# EAGLE schematic testv3 (EAGLE 6.3)
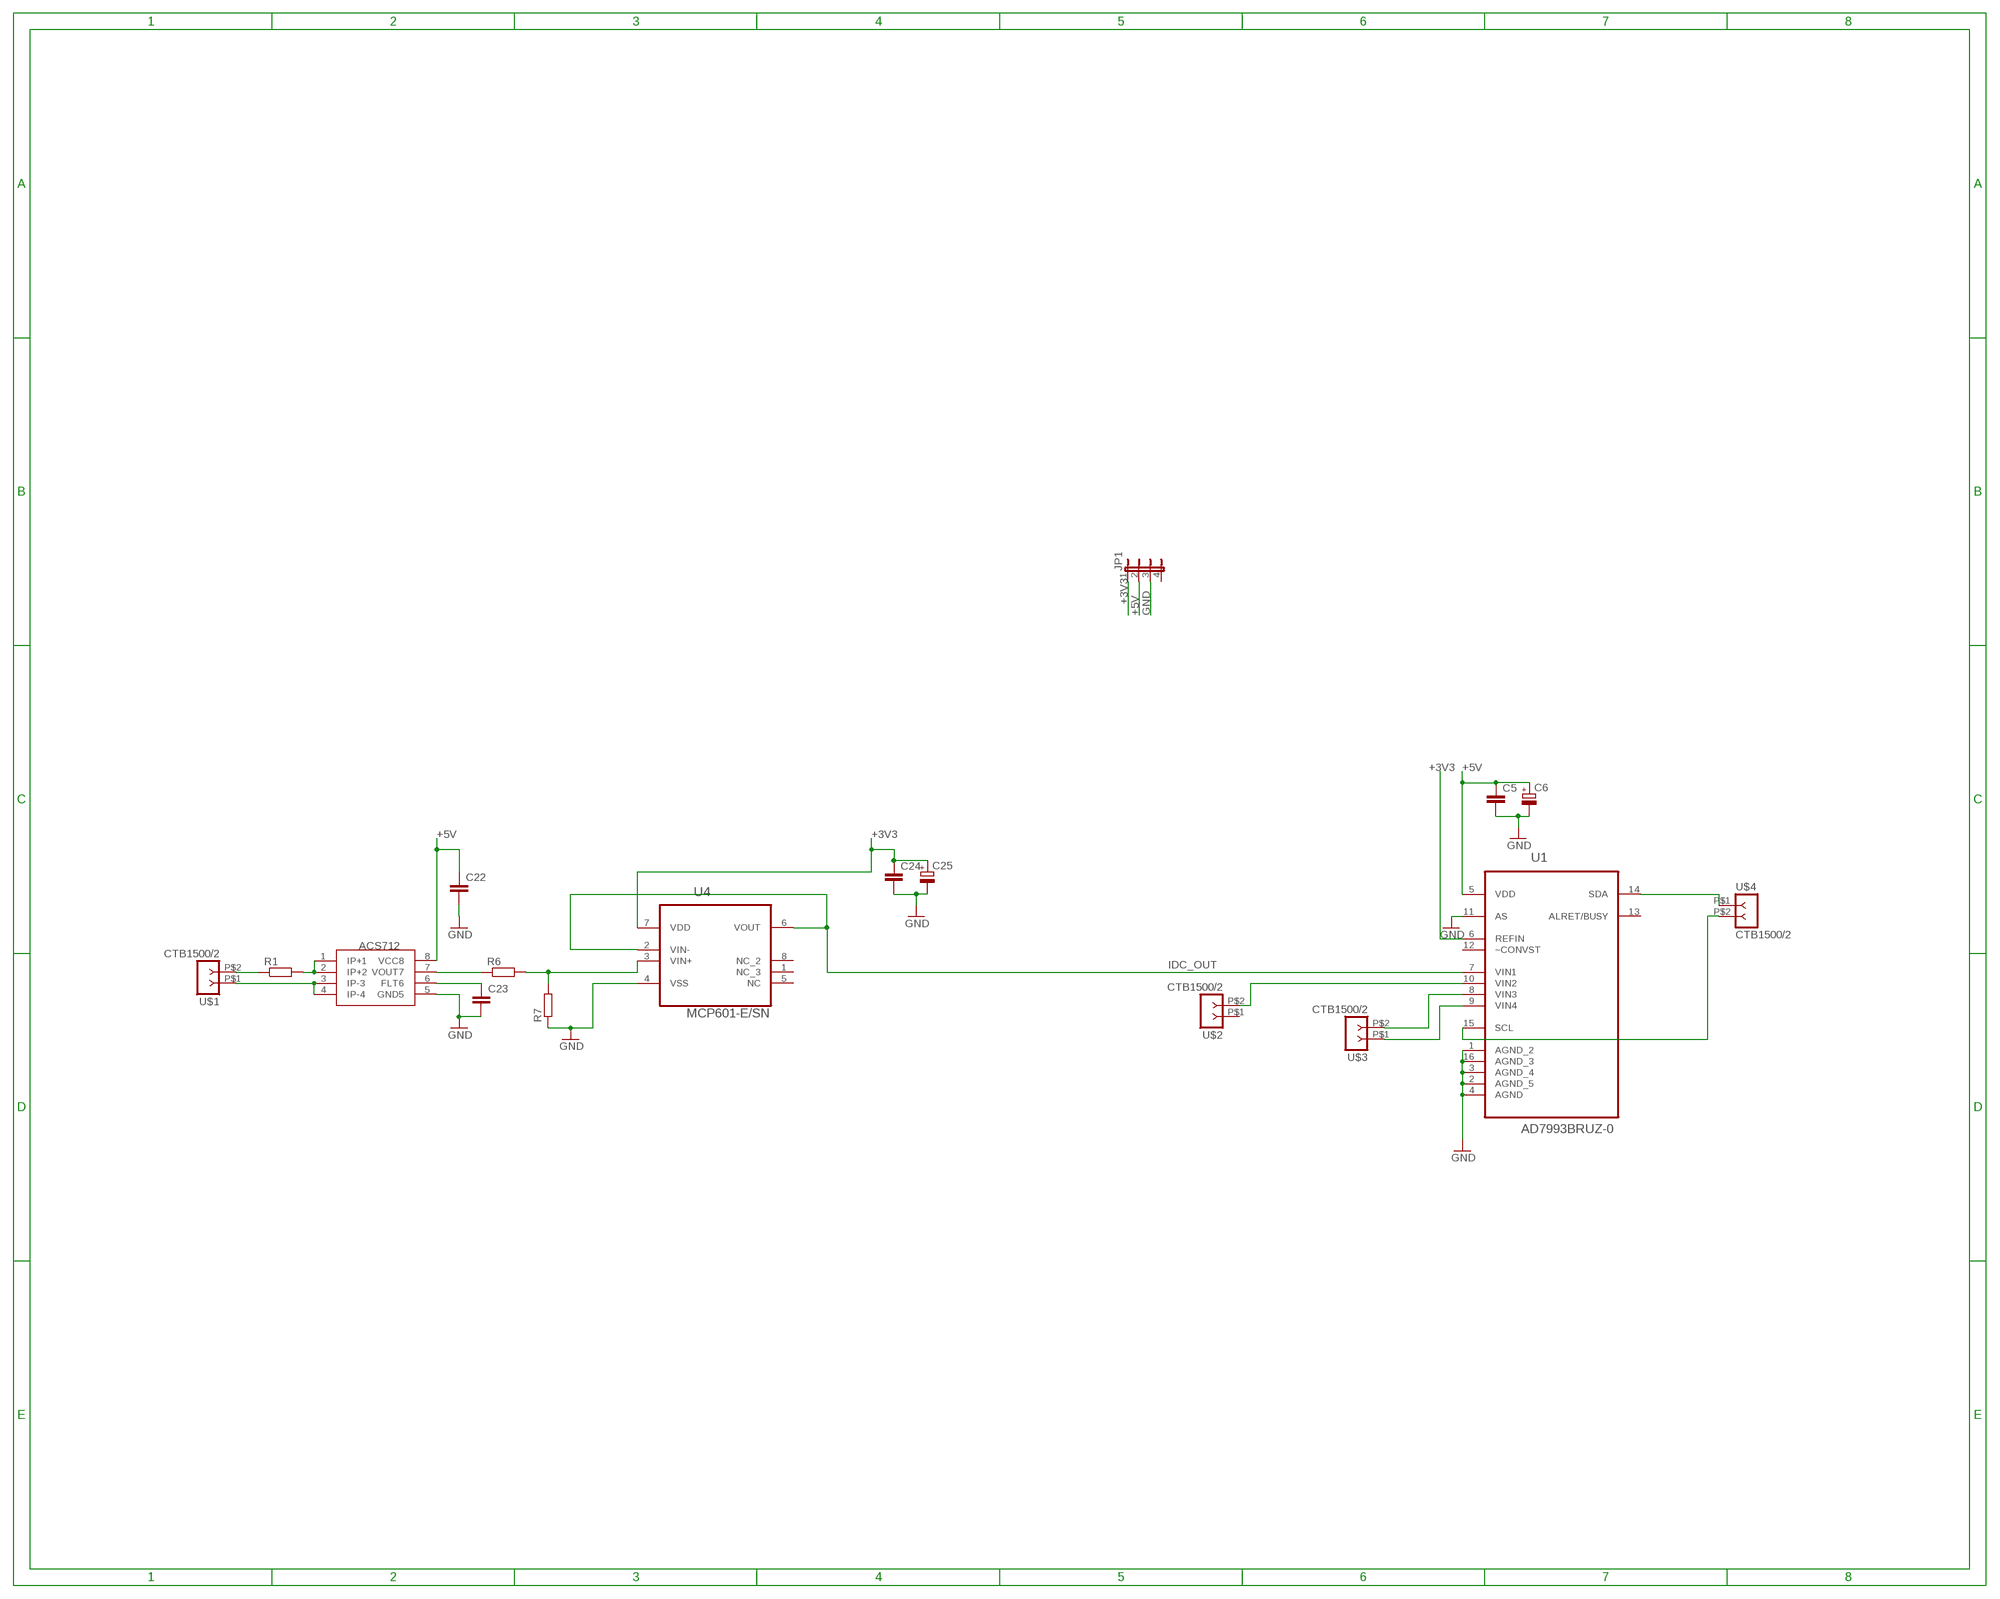
[diagram p0: schematic, sheet 1]

## Parts
C5  C-EU025-025X050  [C025-025X050]
C6  CPOL-EUE2-4  [E2-4]
C22  C-EU025-025X050  [C025-025X050]
C23  C-EU025-025X050  [C025-025X050]
C24  C-EU025-025X050  [C025-025X050]
C25  CPOL-EUE2-4  [E2-4]
JP1  JP4E  [JP4]
R1  R-EU_0207/7  [0207/7]
R6  R-EU_0207/7  [0207/7]
R7  R-EU_0207/7  [0207/7]
U1  AD7993BRUZ-0  [SOP65P640X120-16N]
U4  MCP601-E/SN  [SOIC127P600X175-8N]
U$1  CTB1500/2  [CTB1500-2]
U$2  CTB1500/2  [CTB1500-2]
U$3  CTB1500/2  [CTB1500-2]
U$4  CTB1500/2  [CTB1500-2]
U$10  ACS712  [SOIC8]

## Nets
+3V3: C24.1 C25.+ JP1.1 U1.6(REFIN) U4.7(VDD)
+5V: C5.1 C6.+ C22.1 JP1.2 U1.5(VDD) U$10.8(VCC8)
GND: C5.2 C6.- C22.2 C23.2 C24.2 C25.- JP1.3 R7.1 U1.1(AGND_2) U1.2(AGND_5) U1.3(AGND_4) U1.4(AGND) U1.11(AS) U1.16(AGND_3) U4.4(VSS) U$10.5(GND5)
IDC_OUT: U1.7(VIN1) U4.2(VIN-) U4.6(VOUT)
N$1: U1.9(VIN4) U$3.P$1
N$2: U1.8(VIN3) U$3.P$2
N$3: R1.1 U$1.P$2
N$8: R1.2 U$10.1(IP+1) U$10.2(IP+2)
N$26: U$1.P$1 U$10.3(IP-3) U$10.4(IP-4)
N$27: R6.1 U$10.7(VOUT7)
N$28: C23.1 U$10.6(FLT6)
N$29: R6.2 R7.2 U4.3(VIN+)
N$30: U1.14(SDA) U$4.P$1
SCL: U1.15(SCL) U$4.P$2
VDC_OUT: U1.10(VIN2) U$2.P$2
Unconnected: JP1.4 U1.12(~CONVST) U1.13(ALRET/BUSY) U4.1(NC_3) U4.5(NC) U4.8(NC_2) U$2.P$1

## Library data of the parts
C5 C22-C24 = resistor:C-EU: CAPACITOR, European symbol
C6 C25 = resistor:CPOL-EU: POLARIZED CAPACITOR, European symbol
JP1 = jumper:JP4E: JUMPER
R1 R6 R7 = resistor:R-EU_: RESISTOR, European symbol
U1 = ADC:AD7993BRUZ-0: ADC; MPN: AD7993BRUZ-0; OC_FARNELL: 1078309; OC_NEWARK: 59K6101; PACKAGE: TSSOP-16; SUPPLIER: Analog Devices
U4 = mcp:MCP601-E/SN: IC, 2.7V to 5.5V Single-Supply CMOS Single Op Amps,SOIC-8; MPN: MCP601-E/SN; OC_FARNELL: 1852039; OC_NEWARK: 88H9865; PACKAGE: SOIC-8; SUPPLIER: Microchip
U$1-U$4 = eko-parts:CTB1500/2
U$10 = Pauls_parts:ACS712